# Altium schematic sheet LMV324对射发射板_20260912.SchDoc
size 594 x 419 mm
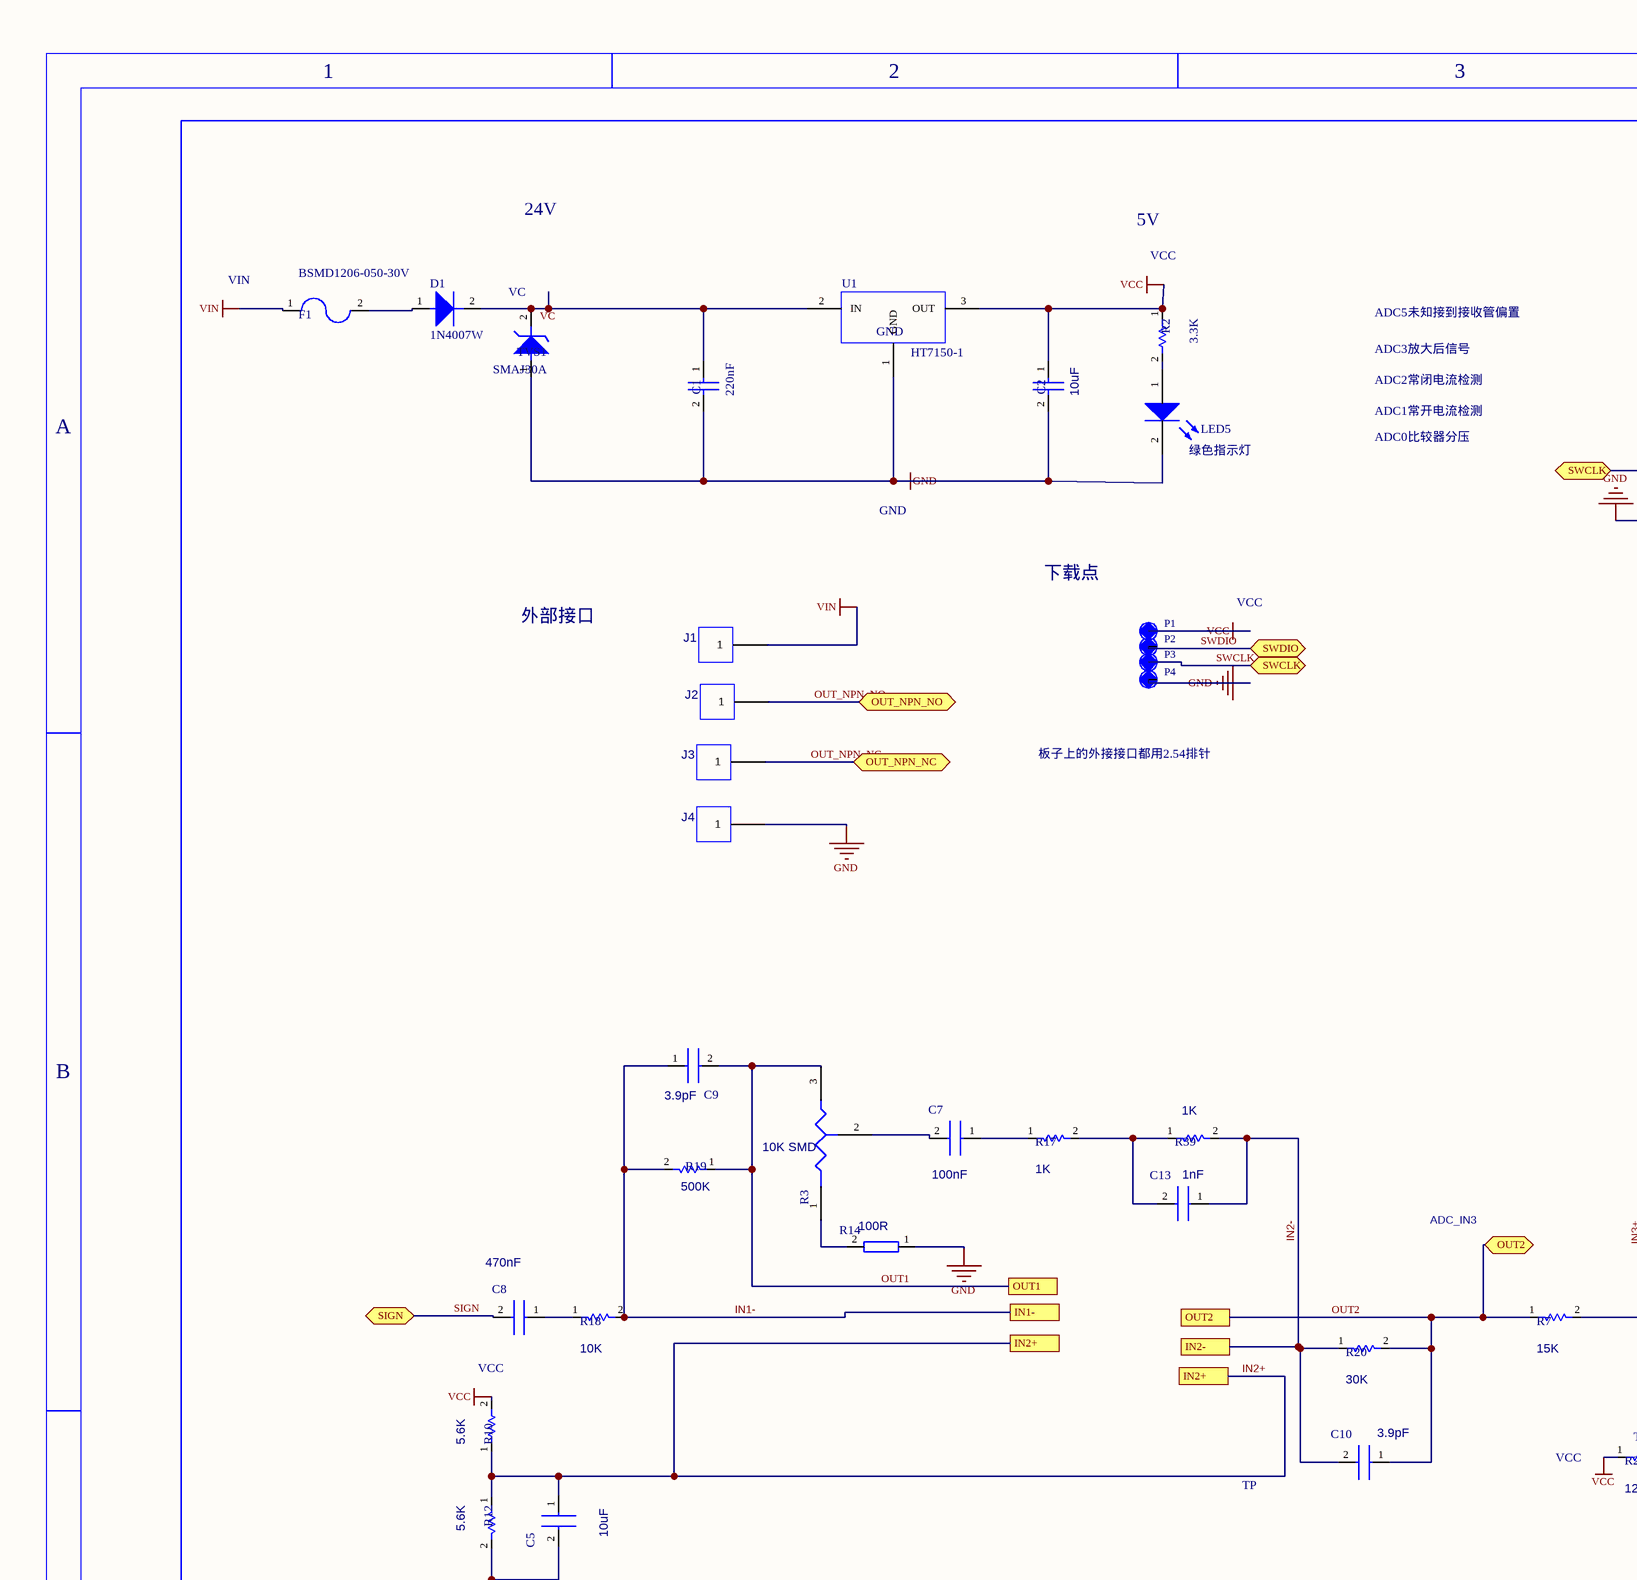
[diagram p0: LMV324对射发射板_20260912.SchDoc, top left]
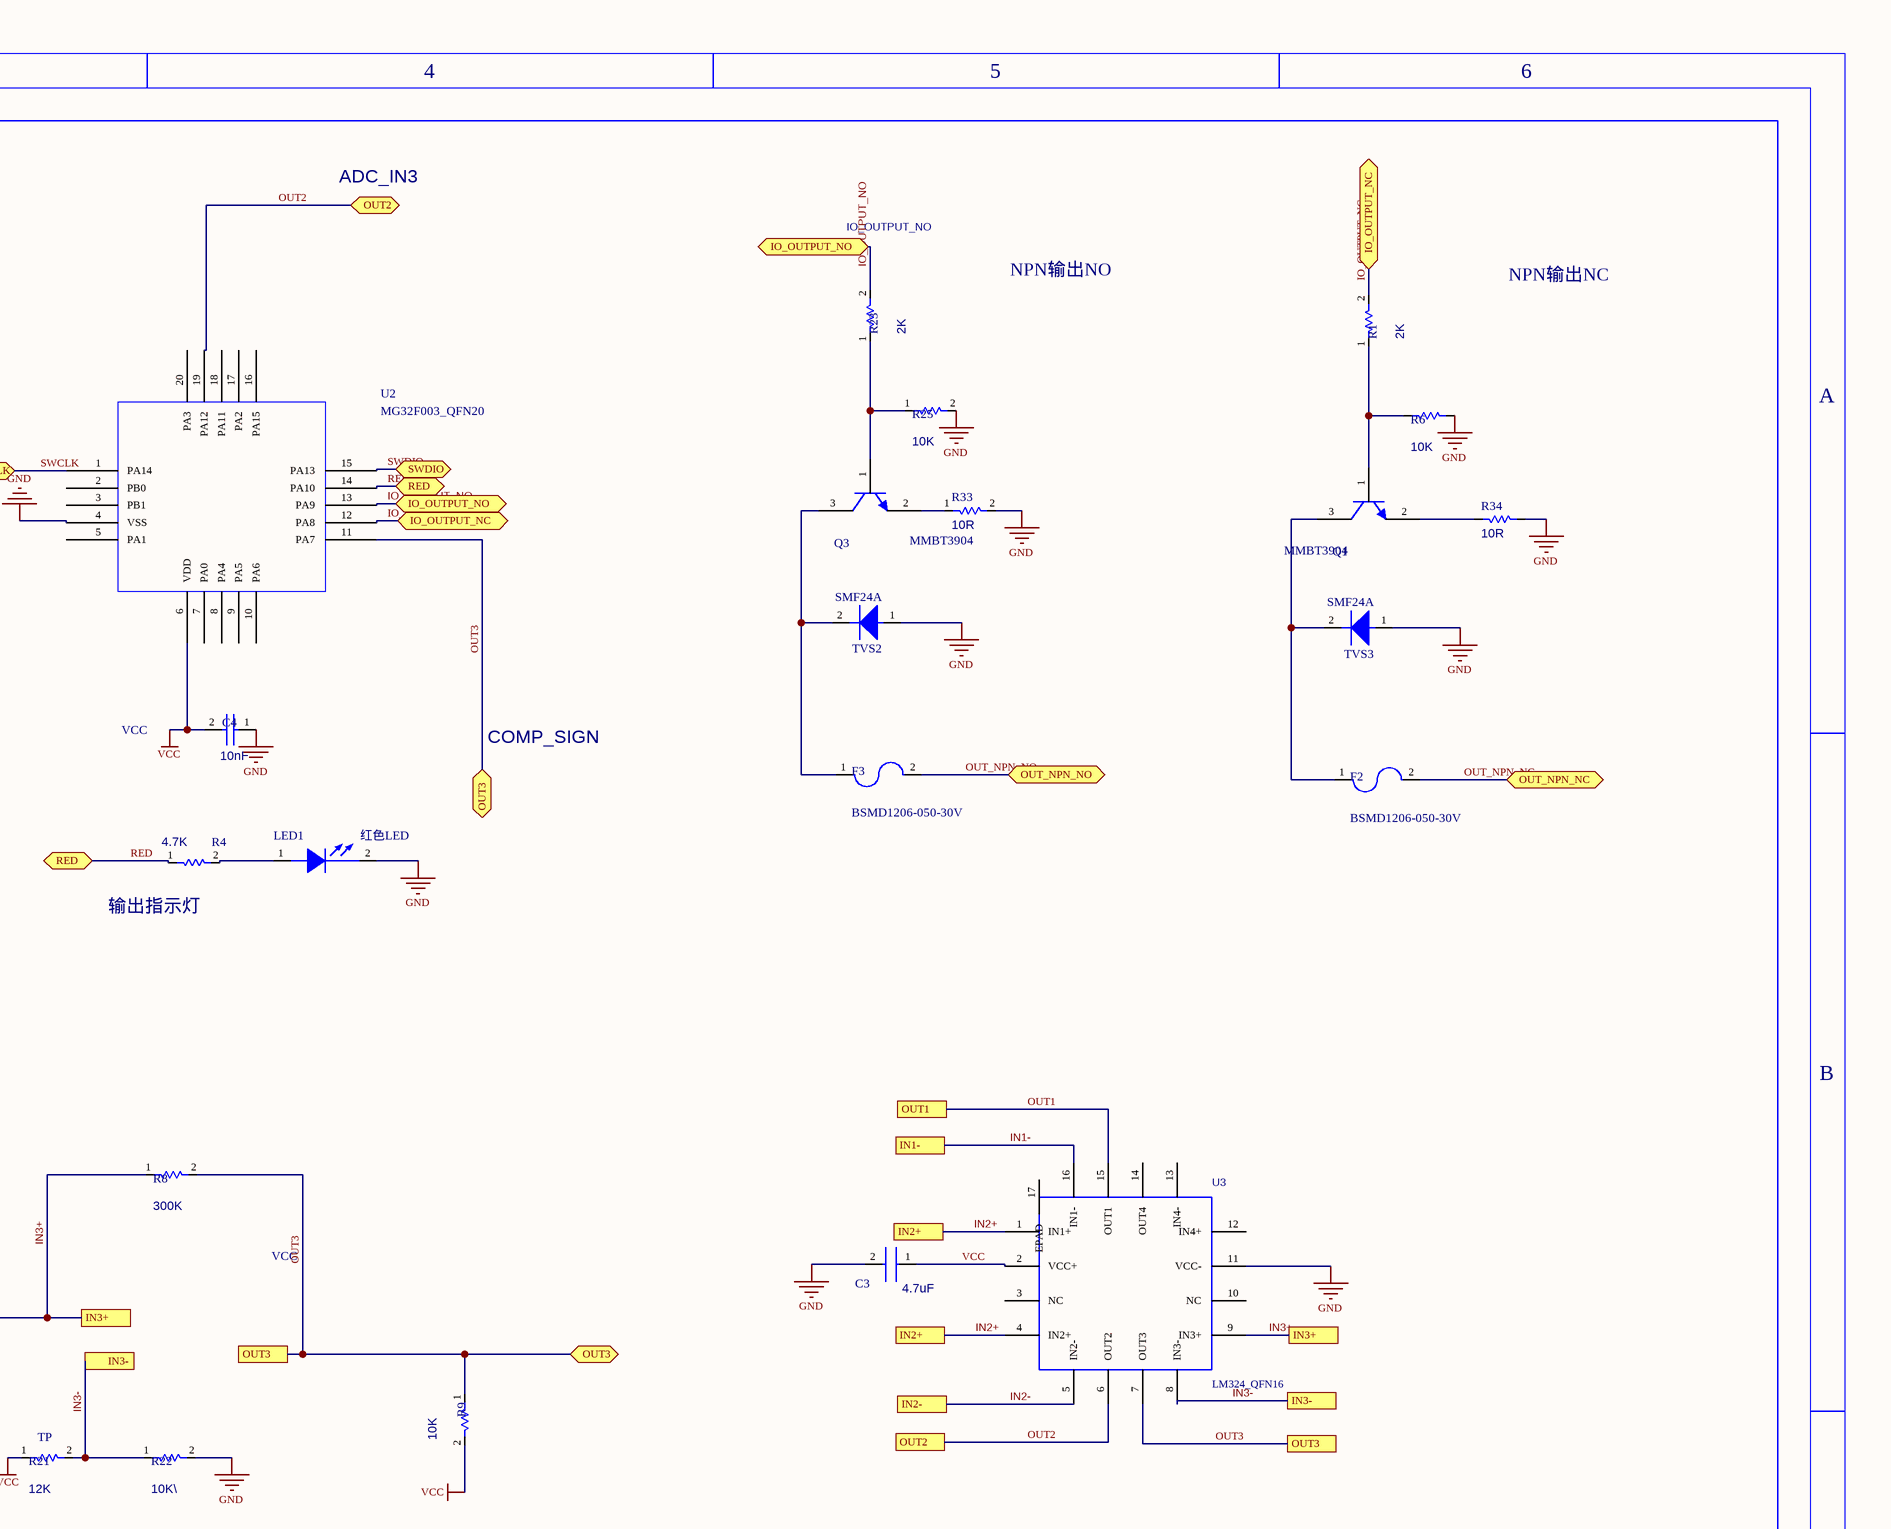
[diagram p1: LMV324对射发射板_20260912.SchDoc, top right]
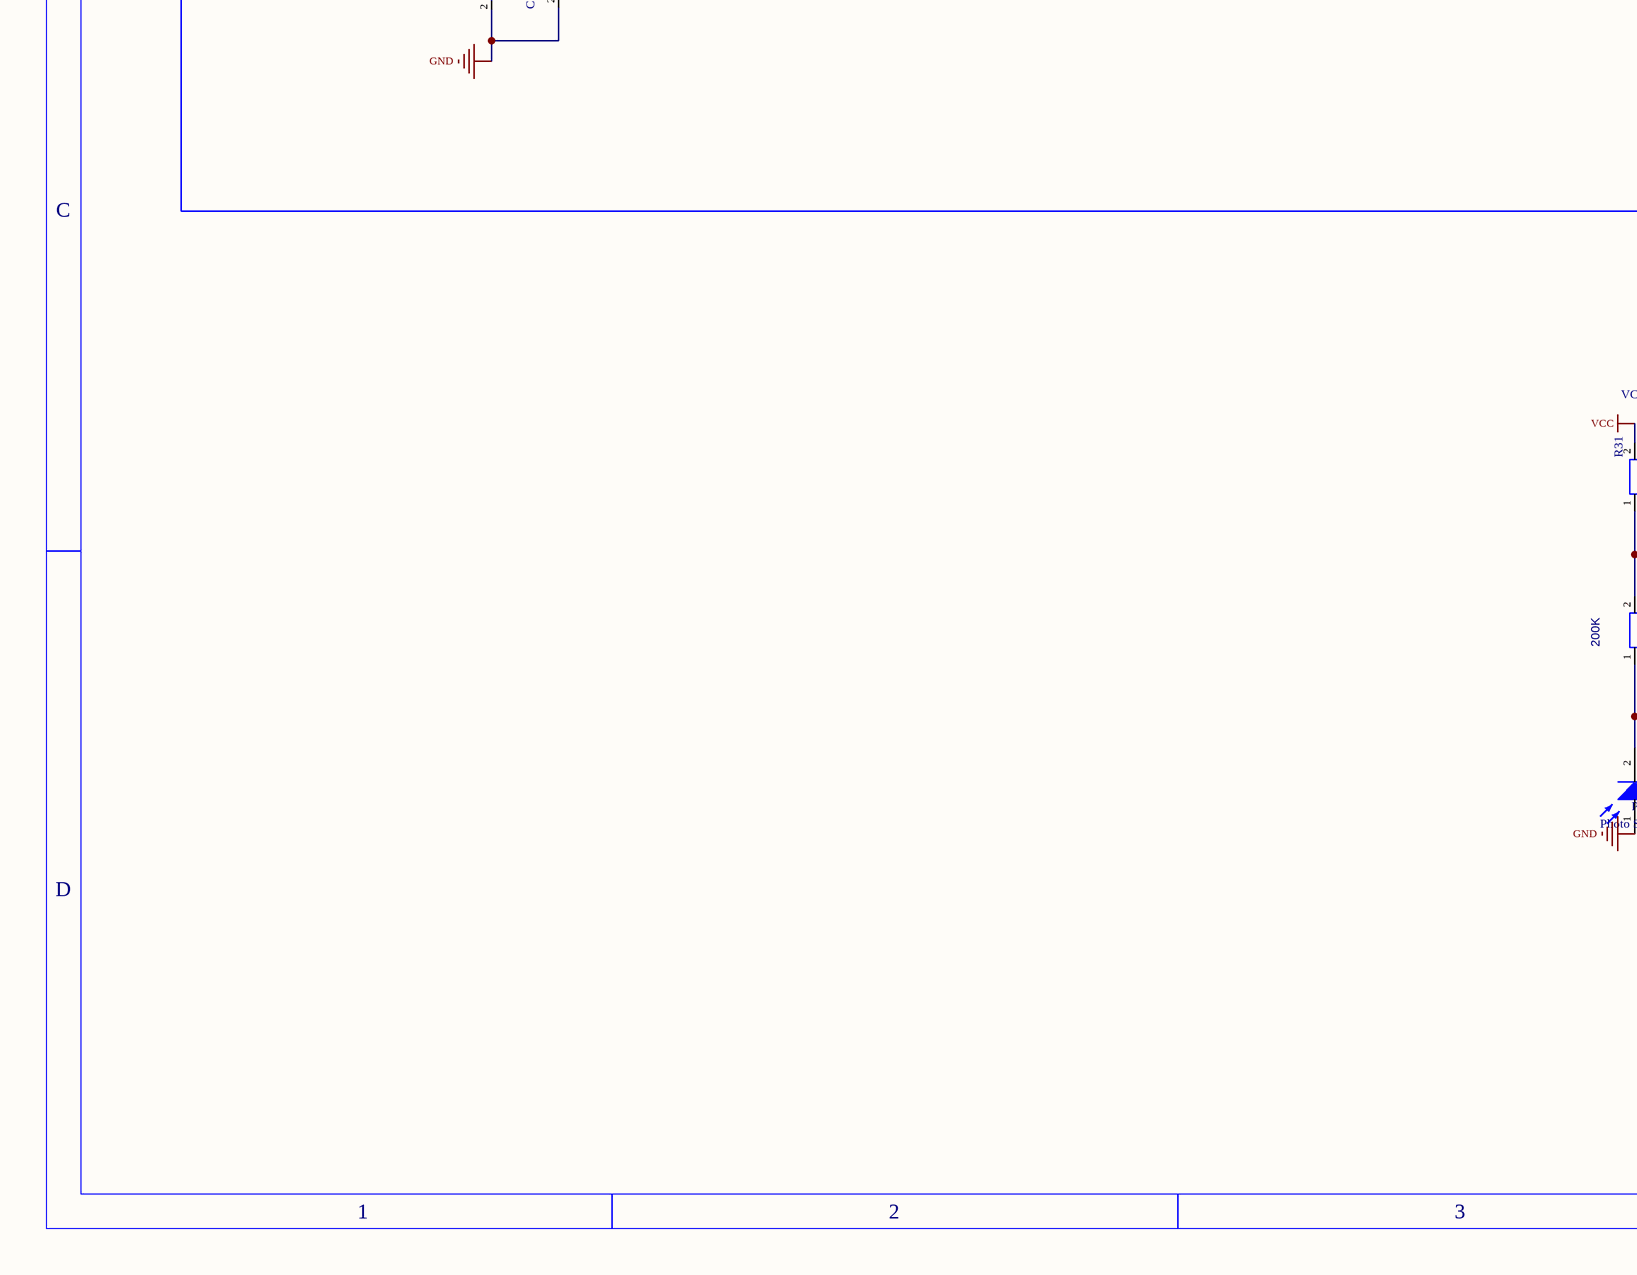
[diagram p2: LMV324对射发射板_20260912.SchDoc, bottom left]
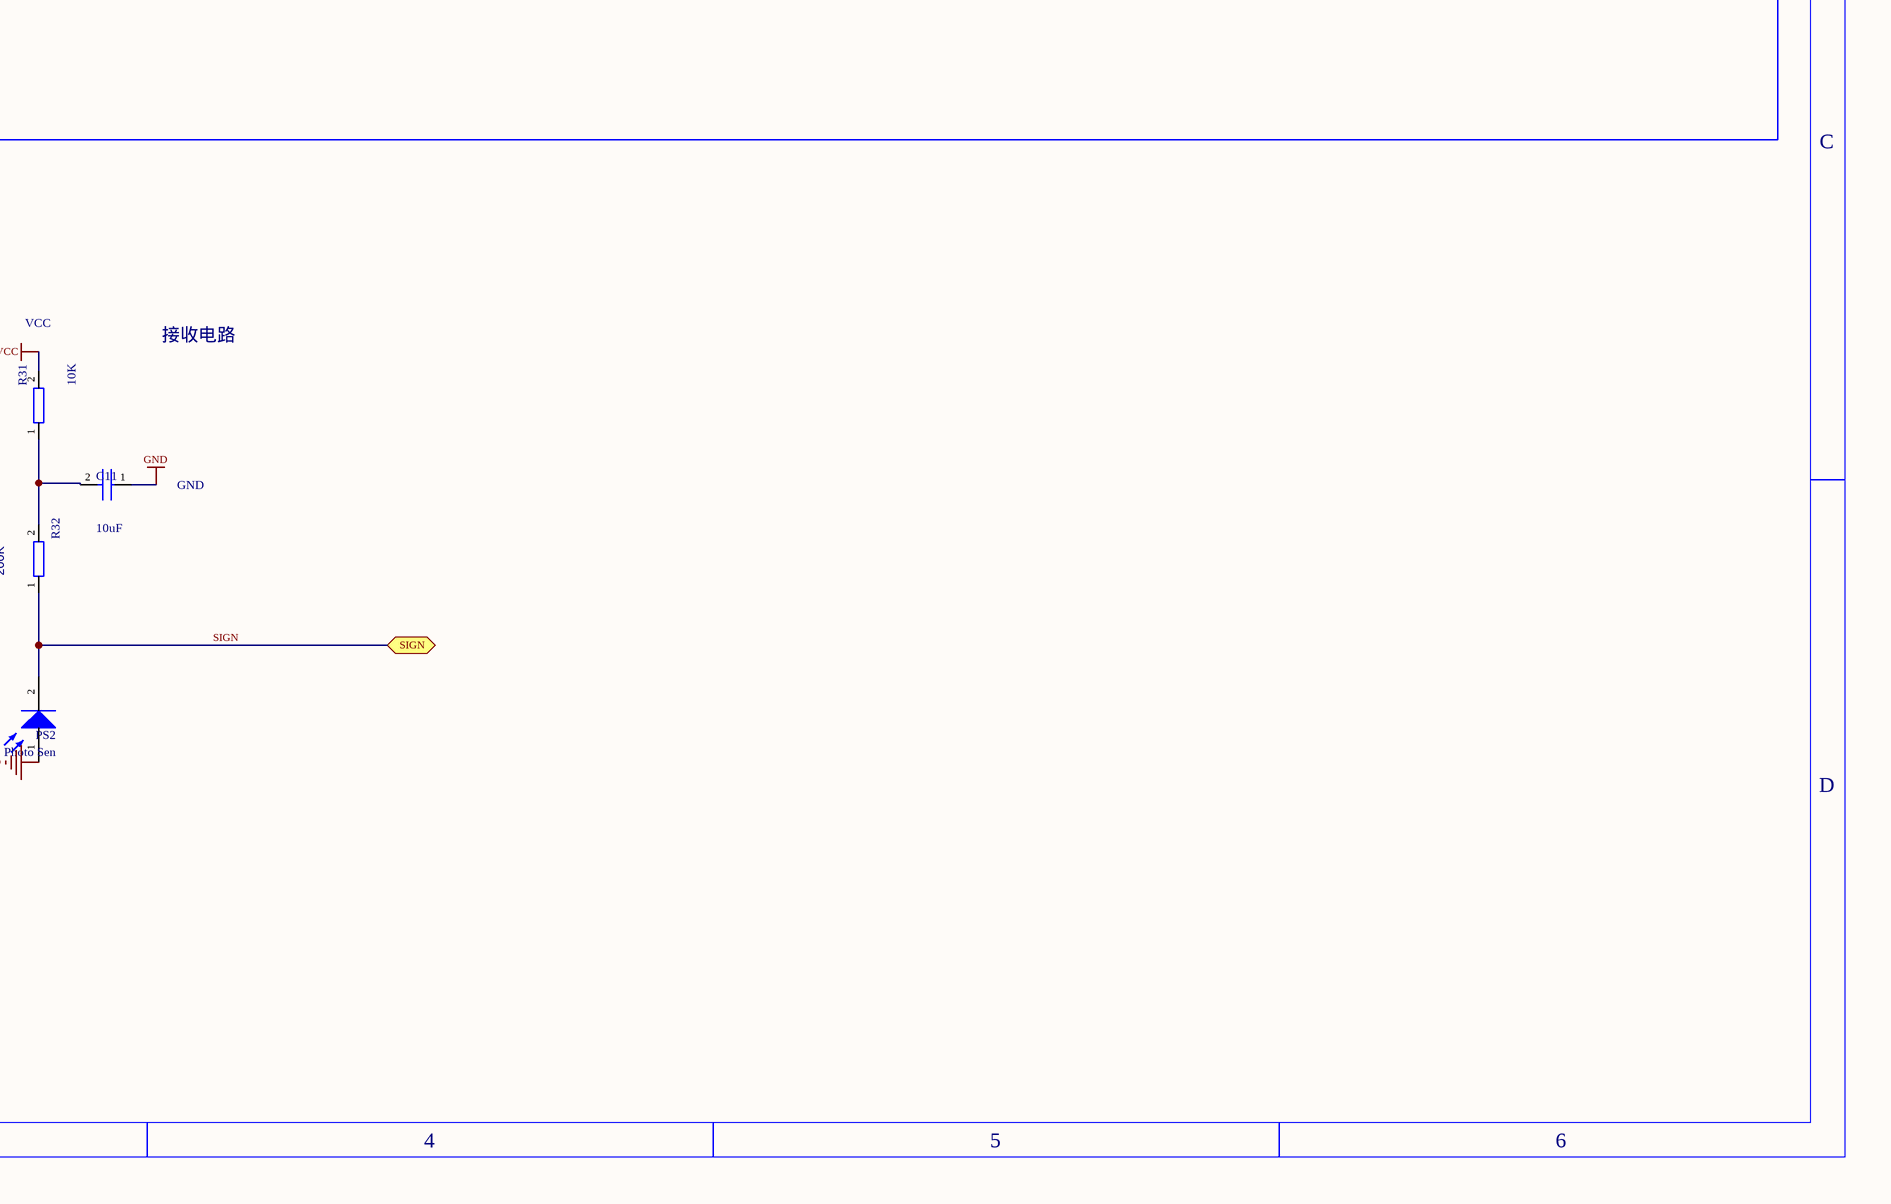
[diagram p3: LMV324对射发射板_20260912.SchDoc, bottom right]

## Parts
C1  CAP  [C0603]  (value not drawn)
C2  CAP  [C0603]  (value not drawn)
C3  CAP_2  [C0603]  (value not drawn)
C4  CAP  [C0603]  (value not drawn)
C5  CAP_2  [C0603]  (value not drawn)
C7  CAP0402  [0402C]  (value not drawn)
C8  CAP0402  [0402C]  (value not drawn)
C9  CAP0402  [0402C]  (value not drawn)
C10  CAP0402  [0402C]  (value not drawn)
C11  CAP_NP  [0603]  (value not drawn)
C13  CAP0402  [0402C]  (value not drawn)
D1  DIODE  [WSOD-323]  (value not drawn)
F1  FUSE  [0603]  (value not drawn)
F2  FUSE  [0603]  (value not drawn)
F3  FUSE  [0603]  (value not drawn)
J1  FPAD_3C  [FPAD_3C]  (value not drawn)
J2  FPAD_3C  [FPAD_3C]  (value not drawn)
J3  FPAD_3C  [FPAD_3C]  (value not drawn)
J4  FPAD_3C  [FPAD_3C]  (value not drawn)
LED1  LED  [LED0603]  (value not drawn)
LED5  LED2  [LED0603]  (value not drawn)
P1  TEST_POINTB+  [TEST-POINT_D1.0]  (value not drawn)
P2  TEST_POINTB+  [TEST-POINT_D1.0]  (value not drawn)
P3  TEST_POINTB+  [TEST-POINT_D1.0]  (value not drawn)
P4  TEST_POINTB+  [TEST-POINT_D1.0]  (value not drawn)
PS2  PHOTO_SEN  [RXLED_SMD]  (value not drawn)
Q1  NPN  [SOT23/2]  (value not drawn)
Q3  NPNSOT23  [SOT23/2]  (value not drawn)
R1  RAS0402  [R0402]  (value not drawn)
R2  RAS0402  [R0402]  (value not drawn)
R3  value 10K SMD  [SMD]  (hidden comment: ADJ_SMD)
R4  RAS  [0603]  (value not drawn)
R6  RAS0402  [R0402]  (value not drawn)
R7  RAS0402  [R0402]  (value not drawn)
R8  RAS0402  [R0402]  (value not drawn)
R9  RAS0402  [R0402]  (value not drawn)
R10  RAS0402  [R0402]  (value not drawn)
R12  RAS0402  [R0402]  (value not drawn)
R14  RES  [R0603]  (value not drawn)
R17  RAS0402  [R0402]  (value not drawn)
R18  RAS0402  [R0402]  (value not drawn)
R19  RAS0402  [R0402]  (value not drawn)
R20  RAS0402  [R0402]  (value not drawn)
R21  RAS0402  [R0402]  (value not drawn)
R22  RAS0402  [R0402]  (value not drawn)
R23  RAS0402  [R0402]  (value not drawn)
R25  RAS0402  [R0402]  (value not drawn)
R31  R0402  [RES0402]  (value not drawn)
R32  R0402  [RES0402]  (value not drawn)
R33  RAS  [0603]  (value not drawn)
R34  RAS  [0603]  (value not drawn)
R39  RAS0402  [R0402]  (value not drawn)
TVS1  DIODE_V  [SOD_523]  (value not drawn)
TVS2  SOD523  [SOD_523]  (value not drawn)
TVS3  SOD523  [SOD_523]  (value not drawn)
U1  HT7530-1  [SOT89]  (value not drawn)
U2  MG32F003-QFN20  [MG32F003_QFN20]  (value not drawn)
U3  LM324_QFN16  [LM324_QFN16]

## Ports
IN1-, IN2+, IN2-, IN3+, IN3-, IO_OUTPUT_NC (bidir), IO_OUTPUT_NO (bidir), OUT1, OUT2, OUT2 (bidir), OUT3, OUT3 (bidir), OUT_NPN_NC (bidir), OUT_NPN_NO (bidir), RED (bidir), SIGN (bidir), SWCLK (bidir), SWDIO (bidir)

## Nets
GND: C1.2 C2.2 C3.2 C4.1 C5.2 C11.1 J4.1 LED1.2(CATHODE) LED5.2(K) P4.1 PS2.1(A) R6.2 R12.2 R14.1 R22.2 R25.2 R33.2 R34.2 TVS1.1 TVS2.1(A) TVS3.1(A) U1.1(GND) U2.4(VSS) U3.11(VCC-)
VC: C1.1 D1.2(K) TVS1.2 U1.2(IN)
VCC: C2.1 C3.1 C4.2 P1.1 R2.1 R9.2 R10.2 R21.1 R31.2 U1.3(OUT) U2.6(VDD) U3.2(VCC+)
VIN: F1.1 J1.1
IN1-: C9.1 R18.2 R19.2 U3.16(IN1-) ; port IN1-
IN2+: C5.1 R10.1 R12.1 U3.1(IN1+) U3.4(IN2+) ; port IN2+
IN2-: C10.2 C13.1 R20.1 R39.2 U3.5(IN2-) ; port IN2-
IN3+: R7.2 R8.1 U3.9(IN3+) ; port IN3+
IN3-: R21.2 R22.1 U3.8(IN3-) ; port IN3-
IO_OUTPUT_NC: R1.2 U2.12(PA8) ; port IO_OUTPUT_NC
IO_OUTPUT_NO: R23.2 U2.13(PA9) ; port IO_OUTPUT_NO
OUT1: C9.2 R3.3(A) R19.1 U3.15(OUT1) ; port OUT1
OUT2: C10.1 R7.1 R20.2 U2.19(PA12) U3.6(OUT2) ; port OUT2
OUT3: R8.2 R9.1 U2.11(PA7) U3.7(OUT3) ; port OUT3
OUT_NPN_NC: F2.2 J3.1 ; port OUT_NPN_NC
OUT_NPN_NO: F3.2 J2.1 ; port OUT_NPN_NO
RED: R4.1 U2.14(PA10) ; port RED
SIGN: C8.2 PS2.2(K) R32.1 ; port SIGN
SWCLK: P3.1 U2.1(PA14) ; port SWCLK
SWDIO: P2.1 U2.15(PA13) ; port SWDIO
NetC7_1: C7.1 R17.1
NetC7_2: C7.2 R3.2(TAP)
NetC8_1: C8.1 R18.1
NetC11_2: C11.2 R31.1 R32.2
NetC13_2: C13.2 R17.2 R39.1
NetD1_1: D1.1(A) F1.2
NetF2_1: F2.1 Q1.3(C) TVS3.2(K)
NetF3_1: F3.1 Q3.3(C) TVS2.2(K)
NetLED1_1: LED1.1(ANODE) R4.2
NetLED5_1: LED5.1(A) R2.2
NetQ1_1: Q1.1(B) R1.1 R6.1
NetQ1_2: Q1.2(E) R34.1
NetQ3_1: Q3.1(B) R23.1 R25.1
NetQ3_2: Q3.2(E) R33.1
NetR3_1: R3.1(B) R14.2

Not connected (* = marked no-connect by the designer): U2 2(PB0) 3(PB1) 5(PA1) 7(PA0) 8(PA4) 9(PA5) 10(PA6) 16(PA15) 17(PA2) 18(PA11) 20(PA3); U3 3(NC) 10(NC) 12(IN4+) 13(IN4-) 14(OUT4) 17(EPAD)

## Notes on the sheet
- 1
- 2
- 3
- 4
- 5
- 6
- 24V
- ADC_IN3
- (near F1) VIN
- (near TVS1) VC
- 5V
- (near R2) VCC
- (near R23) IO_OUTPUT_NO
- NPN输出NO
- NPN输出NC
- ADC2常闭电流检测
- ADC3放大后信号
- ADC5未知接到接收管偏置
- A
- ADC0比较器分压
- ADC1常开电流检测
- GND
- 外部接口
- 下载点
- VCC
- 板子上的外接接口都用2.54排针
- COMP_SIGN
- (near R4) 输出指示灯
- B
- (near R21) TP
- TP
- (near R21) VCC
- C
- (near R31) VCC
- 接收电路
- (near C11) GND
- D

## Library data of the parts
C1 C2 C4 = CAP: 陶瓷电容; PCB DECAL: C0603
C7-C10 C13 = CAP0402: Capacitor; PCB DECAL: 0402C
C11 = CAP_NP: Text_Field1: 20; Text_Field2: 10; PCB DECAL: 0603
J1-J4 = FPAD_3C: Connector; PCB DECAL: FPAD_3C
LED1 = LED: Text_Field1: 40; Text_Field2: 20; PCB DECAL: LED0603
LED5 = LED2: Typical RED, GREEN, YELLOW, AMBER GaAs LED; Published: 8-Jun-2000; LatestRevisionDate: 17-Jul-2002; LatestRevisionNote: Re-released for DXP Platform.; PackageVersion: Feb-2002; PackageReference: 3.2X1.6X1.1; Publisher: Altium Limited; PackageDescription: SM LED; 2 Flat Leads; PCB DECAL: LED0603
PS2 = PHOTO_SEN: Photosensitive Diode; Published: 24-Mar-1999; LatestRevisionDate: 17-Jul-2002; LatestRevisionNote: Re-released for DXP Platform.; PackageReference: PIN2; Publisher: Altium Limited; PCB DECAL: RXLED_SMD
Q1 = NPN: NPN Bipolar Transistor; Published: 8-Jun-2000; LatestRevisionDate: 17-Jul-2002; LatestRevisionNote: Re-released for DXP Platform.; PackageReference: TO-226-AA; Publisher: Altium Limited; PackageDescription: TO, Flat Index; 3 In-Line, Axial Leads; Body Dia. 4.8mm; Leads 0.55 x 0.51 mm (max); Code_JEDEC: TO-226-AA; PCB DECAL: SOT23/2
Q3 = NPNSOT23: NPN Bipolar Transistor; Published: 8-Jun-2000; LatestRevisionDate: 17-Jul-2002; LatestRevisionNote: Re-released for DXP Platform.; PackageReference: TO-226-AA; Publisher: Altium Limited; PackageDescription: TO, Flat Index; 3 In-Line, Axial Leads; Body Dia. 4.8mm; Leads 0.55 x 0.51 mm (max); Code_JEDEC: TO-226-AA; PCB DECAL: SOT23/2
R3 = ADJ_SMD: Tapped Resistor; Sim_Note: Enter the Resistance value and the set point into parameter fields.; Set_Position: 0.5; Published: 24-Mar-1999; LatestRevisionDate: 17-Jul-2002; LatestRevisionNote: Re-released for DXP Platform.; PackageReference: VR3; Publisher: Altium Limited; PackageDescription: Variable Resistor, Thru-Hole; 3 Leads; PCB DECAL: SMD
R31 R32 = R0402: Text_Field1: 20; Text_Field2: 30; Geometry.Height: 0.4; Value: 1K; PCB DECAL: RES0402
TVS1 = DIODE_V: Varactor Diode; PCB DECAL: SOD_523
TVS2 TVS3 = SOD523: Diode; Published: 12-Feb-2010; DatasheetVersion: Rev.3.00, May-2003; PackageVersion: Aug-2005; PackageReference: GLZZ0002ZA-A; Publisher: Altium Limited; PackageDescription: Metal Electrode Face (MELF) Diode; Body 3.5 x 1.35 mm (LxDia); ComponentLink1Description: Manufacturer Link; ComponentLink1URL: http://sg.renesas.com/fmwk.jsp?cnt=diode_landing.jsp&fp=/products/discrete/diodes/; ComponentLink2Description: Datasheet; ComponentLink2URL: http://documentation.renesas.com/eng/products/diode/rej03g0018_hzk.pdf; ComponentLink3Description: Packaging Specification; ComponentLink3URL: http://sg.renesas.com/media/products/common_info/package/pdf/diode/code/glzz0002za_a.pdf; PCB DECAL: SOD_523
U1 = HT7530-1: 3.0V 100mA Low Power,  Low Dropout Voltage (LDO) Regulator; Published: 30-Mar-2007; DatasheetVersion: rev1.50, Jan-2006; PackageVersion: Jan-2006; PackageReference: SOT-89; Publisher: Altium Limited; PackageDescription: 3-Pin SOT-89 Package 1.5 mm Pitch, 4.1 mm Lead Span; Code_IPC: SOT89; ComponentLink1Description: Manufacturer Link; ComponentLink1URL: http://www.holtek.com/; ComponentLink2Description: Datasheet; ComponentLink2URL: http://www.holtek.com/pdf/consumer/75xx_1v150.pdf; PCB DECAL: SOT89
U2 = MG32F003-QFN20: QFN20主控芯片; PCB DECAL: MG32F003_QFN20
C3 C5 = CAP_2: PCB DECAL: C0603
D1 = DIODE: Description: Diode; PCB DECAL: WSOD-323
F1-F3 = FUSE: Description: Fuse; PCB DECAL: 0603
P1-P4 = TEST_POINTB+: PCB DECAL: TEST-POINT_D1.0
R1 R2 R6-R10 R12 R17-R23 R25 R39 = RAS0402: PCB DECAL: R0402
R4 R33 R34 = RAS: PCB DECAL: 0603
R14 = RES: PCB DECAL: R0603
U3 = LM324_QFN16: PCB DECAL: LM324_QFN16